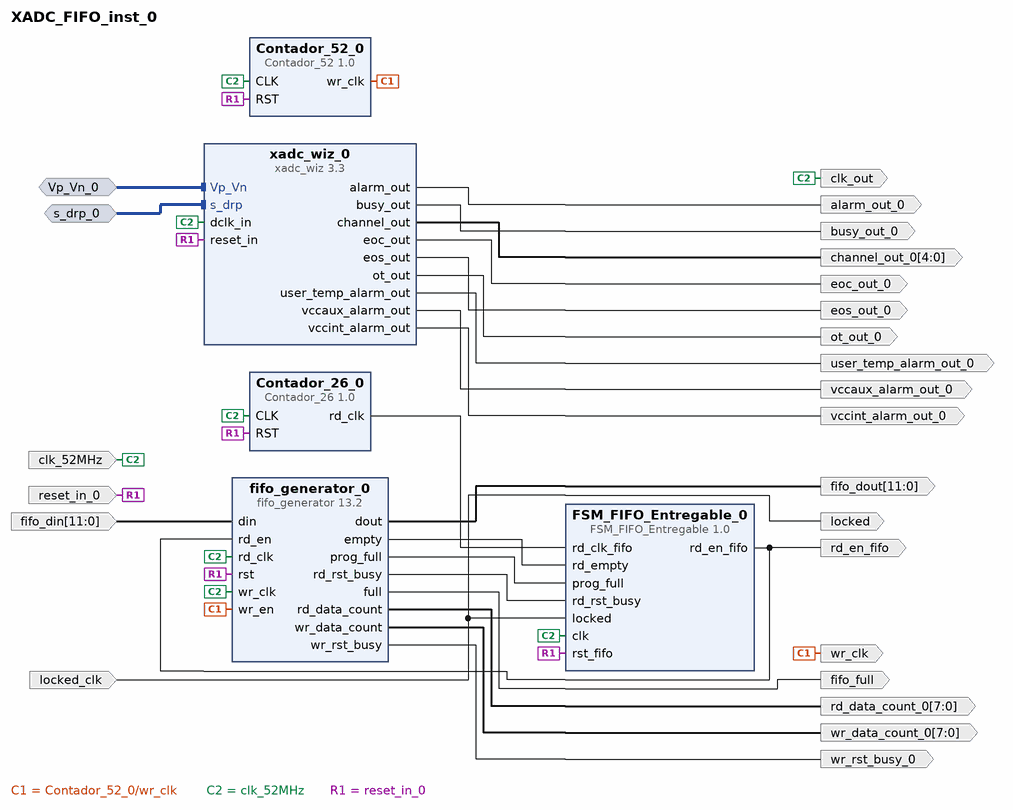
[diagram p0: block diagram of the top level]
# Vivado block design XADC_FIFO_inst_0, xc7vx485tffg1157-1, Vivado 2021.2
create_bd_design XADC_FIFO_inst_0

create_bd_intf_port -mode Slave -vlnv xilinx.com:interface:diff_analog_io_rtl:1.0 Vp_Vn_0
create_bd_intf_port -mode Slave -vlnv xilinx.com:interface:drp_rtl:1.0 s_drp_0
create_bd_port -dir O alarm_out_0
create_bd_port -dir O busy_out_0
create_bd_port -dir O -from 4 -to 0 channel_out_0
create_bd_port -dir I clk_52MHz
create_bd_port -dir O clk_out
create_bd_port -dir O eoc_out_0
create_bd_port -dir O eos_out_0
create_bd_port -dir I -from 11 -to 0 fifo_din
create_bd_port -dir O -from 11 -to 0 fifo_dout
create_bd_port -dir O fifo_full
create_bd_port -dir O locked
create_bd_port -dir I locked_clk
create_bd_port -dir O ot_out_0
create_bd_port -dir O -from 7 -to 0 rd_data_count_0
create_bd_port -dir O rd_en_fifo
create_bd_port -dir I -type rst reset_in_0
create_bd_port -dir O user_temp_alarm_out_0
create_bd_port -dir O vccaux_alarm_out_0
create_bd_port -dir O vccint_alarm_out_0
create_bd_port -dir O wr_clk
create_bd_port -dir O -from 7 -to 0 wr_data_count_0
create_bd_port -dir O wr_rst_busy_0

create_bd_cell -type ip -vlnv xilinx.com:user:Contador_26:1.0 Contador_26_0
create_bd_cell -type ip -vlnv xilinx.com:user:Contador_52:1.0 Contador_52_0
create_bd_cell -type ip -vlnv xilinx.com:user:FSM_FIFO_Entregable:1.0 FSM_FIFO_Entregable_0
create_bd_cell -type ip -vlnv xilinx.com:ip:fifo_generator:13.2 fifo_generator_0
set_property -dict [list \
  CONFIG.Enable_Safety_Circuit true \
  CONFIG.Fifo_Implementation Independent_Clocks_Block_RAM \
  CONFIG.Full_Flags_Reset_Value 1 \
  CONFIG.Full_Threshold_Assert_Value 200 \
  CONFIG.Input_Data_Width 12 \
  CONFIG.Input_Depth 256 \
  CONFIG.Output_Data_Width 12 \
  CONFIG.Programmable_Full_Type Single_Programmable_Full_Threshold_Constant \
  CONFIG.Read_Data_Count true \
  CONFIG.Read_Data_Count_Width 8 \
  CONFIG.Write_Data_Count true \
  CONFIG.Write_Data_Count_Width 8 \
] [get_bd_cells fifo_generator_0]
create_bd_cell -type ip -vlnv xilinx.com:ip:xadc_wiz:3.3 xadc_wiz_0
set_property -dict [list \
  CONFIG.ADC_CONVERSION_RATE 1000 \
  CONFIG.ADC_OFFSET_AND_GAIN_CALIBRATION true \
  CONFIG.DCLK_FREQUENCY 52 \
  CONFIG.ENABLE_RESET true \
  CONFIG.INTERFACE_SELECTION ENABLE_DRP \
  CONFIG.OT_ALARM true \
  CONFIG.SENSOR_OFFSET_AND_GAIN_CALIBRATION true \
  CONFIG.SINGLE_CHANNEL_SELECTION VP_VN \
  CONFIG.STIMULUS_FREQ 1.0 \
  CONFIG.TEMPERATURE_ALARM_RESET 50.0 \
  CONFIG.TEMPERATURE_ALARM_TRIGGER 60.0 \
  CONFIG.WAVEFORM_TYPE TRIANGLE \
] [get_bd_cells xadc_wiz_0]

# ---- connections ----

connect_bd_intf_net -intf_net Vp_Vn_0_1 [get_bd_intf_ports Vp_Vn_0] [get_bd_intf_pins xadc_wiz_0/Vp_Vn]
connect_bd_intf_net -intf_net s_drp_0_1 [get_bd_intf_ports s_drp_0] [get_bd_intf_pins xadc_wiz_0/s_drp]
connect_bd_net [get_bd_pins Contador_26_0/rd_clk] [get_bd_pins FSM_FIFO_Entregable_0/rd_clk_fifo]
connect_bd_net [get_bd_pins Contador_52_0/wr_clk] [get_bd_pins fifo_generator_0/wr_en] [get_bd_ports wr_clk]
connect_bd_net [get_bd_pins FSM_FIFO_Entregable_0/rd_en_fifo] [get_bd_pins fifo_generator_0/rd_en] [get_bd_ports rd_en_fifo]
connect_bd_net -net clk_wiz_0_clk_out1 [get_bd_ports clk_52MHz] \
  [get_bd_pins Contador_52_0/CLK] [get_bd_pins Contador_26_0/CLK] [get_bd_pins fifo_generator_0/wr_clk] \
  [get_bd_pins fifo_generator_0/rd_clk] [get_bd_pins xadc_wiz_0/dclk_in] [get_bd_ports clk_out] \
  [get_bd_pins FSM_FIFO_Entregable_0/clk]
connect_bd_net -net clk_wiz_0_locked [get_bd_ports locked_clk] [get_bd_ports locked] [get_bd_pins FSM_FIFO_Entregable_0/locked]
connect_bd_net [get_bd_ports fifo_din] [get_bd_pins fifo_generator_0/din]
connect_bd_net [get_bd_pins fifo_generator_0/dout] [get_bd_ports fifo_dout]
connect_bd_net [get_bd_pins fifo_generator_0/empty] [get_bd_pins FSM_FIFO_Entregable_0/rd_empty]
connect_bd_net [get_bd_pins fifo_generator_0/full] [get_bd_ports fifo_full]
connect_bd_net [get_bd_pins fifo_generator_0/prog_full] [get_bd_pins FSM_FIFO_Entregable_0/prog_full]
connect_bd_net [get_bd_pins fifo_generator_0/rd_data_count] [get_bd_ports rd_data_count_0]
connect_bd_net [get_bd_pins fifo_generator_0/rd_rst_busy] [get_bd_pins FSM_FIFO_Entregable_0/rd_rst_busy]
connect_bd_net [get_bd_pins fifo_generator_0/wr_data_count] [get_bd_ports wr_data_count_0]
connect_bd_net [get_bd_pins fifo_generator_0/wr_rst_busy] [get_bd_ports wr_rst_busy_0]
connect_bd_net -net reset_in_0_1 [get_bd_ports reset_in_0] \
  [get_bd_pins fifo_generator_0/rst] [get_bd_pins Contador_26_0/RST] [get_bd_pins Contador_52_0/RST] \
  [get_bd_pins xadc_wiz_0/reset_in] [get_bd_pins FSM_FIFO_Entregable_0/rst_fifo]
connect_bd_net [get_bd_pins xadc_wiz_0/alarm_out] [get_bd_ports alarm_out_0]
connect_bd_net [get_bd_pins xadc_wiz_0/busy_out] [get_bd_ports busy_out_0]
connect_bd_net [get_bd_pins xadc_wiz_0/channel_out] [get_bd_ports channel_out_0]
connect_bd_net [get_bd_pins xadc_wiz_0/eoc_out] [get_bd_ports eoc_out_0]
connect_bd_net [get_bd_pins xadc_wiz_0/eos_out] [get_bd_ports eos_out_0]
connect_bd_net [get_bd_pins xadc_wiz_0/ot_out] [get_bd_ports ot_out_0]
connect_bd_net [get_bd_pins xadc_wiz_0/user_temp_alarm_out] [get_bd_ports user_temp_alarm_out_0]
connect_bd_net [get_bd_pins xadc_wiz_0/vccaux_alarm_out] [get_bd_ports vccaux_alarm_out_0]
connect_bd_net [get_bd_pins xadc_wiz_0/vccint_alarm_out] [get_bd_ports vccint_alarm_out_0]

validate_bd_design
save_bd_design
